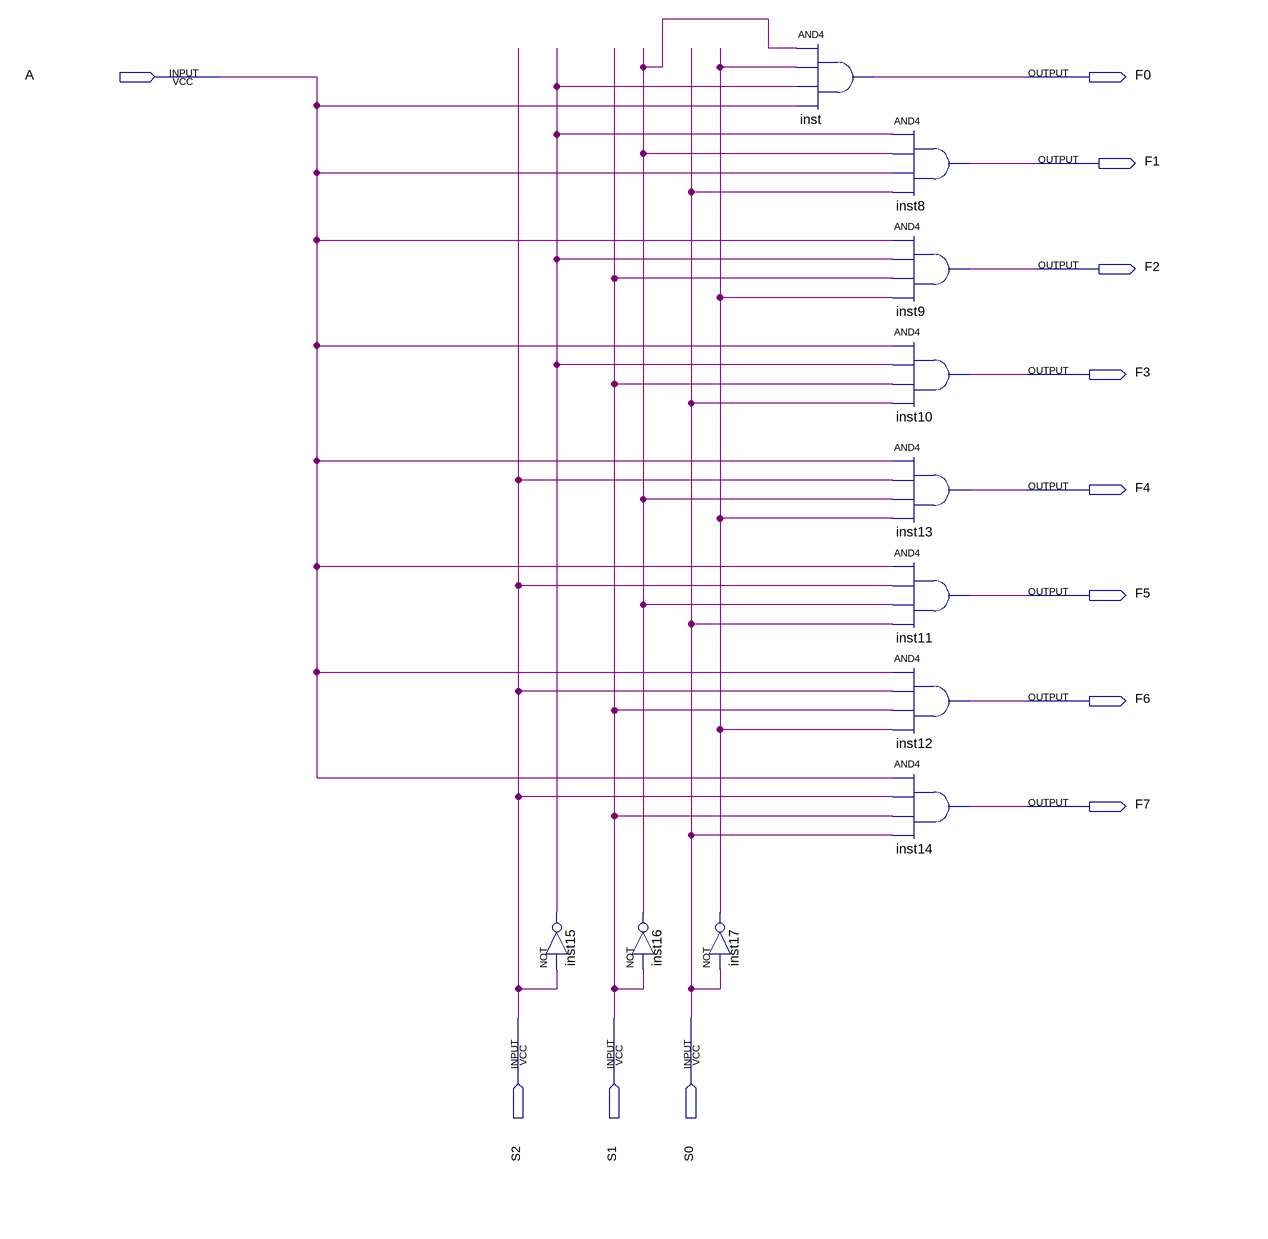
[diagram p0: schematic sheet]
// Quartus schematic Mux_demux.bdf as structural Verilog: 11 symbols, 12 pins
module Mux_demux (
  input  A,
  input  S2,
  input  S1,
  input  S0,
  output F0,
  output F1,
  output F2,
  output F3,
  output F4,
  output F5,
  output F6,
  output F7
);

  wire inst15_out, inst16_out, inst17_out;

  not inst15 (inst15_out, S2);
  not inst16 (inst16_out, S1);
  not inst17 (inst17_out, S0);
  and inst (F0, inst16_out, inst17_out, inst15_out, A);
  and inst8 (F1, inst15_out, inst16_out, A, S0);
  and inst9 (F2, A, inst15_out, S1, inst17_out);
  and inst10 (F3, A, inst15_out, S1, S0);
  and inst13 (F4, A, S2, inst16_out, inst17_out);
  and inst11 (F5, A, S2, inst16_out, S0);
  and inst12 (F6, A, S2, S1, inst17_out);
  and inst14 (F7, A, S2, S1, S0);
endmodule
